# EAGLE design column (EAGLE 6.2)
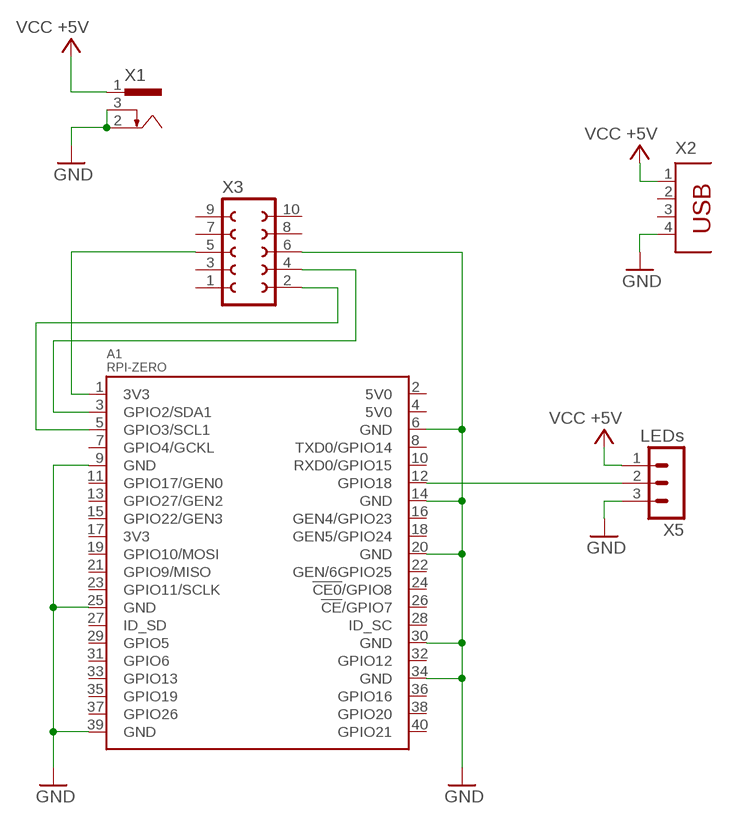
[diagram p0: schematic, sheet 1]

## Parts
A1  RPI-ZERO  [RASP_PI_ZERO_BOARD_FULL]
X1  733980-62  [733980-62]
X2  PN87520  [PN87520]
X3  FE05-2  [FE05-2]
X5  LEDs  MA03-1  [MA03-1]

## Nets
3V3@1: A1.1(3V3) X3.5
GND: A1.6(GND) A1.9(GND) A1.14(GND) A1.20(GND) A1.25(GND) A1.30(GND) A1.34(GND) A1.39(GND) X1.2 X1.3 X2.4 X3.6 X5.3
N$1: A1.5(GPIO3/SCL1) X3.2
N$2: A1.3(GPIO2/SDA1) X3.4
N$3: A1.12(GPIO18) X5.2
VCC: X1.1 X2.1 X5.1 ; supply symbol labelled VCC +5V
Unconnected: A1.2(5V0) A1.4(5V0) A1.7(GPIO4/GCKL) A1.8(TXD0/GPIO14) A1.10(RXD0/GPIO15) A1.11(GPIO17/GEN0) A1.13(GPIO27/GEN2) A1.15(GPIO22/GEN3) A1.16(GEN4/GPIO23) A1.17(3V3) A1.18(GEN5/GPIO24) A1.19(GPIO10/MOSI) A1.21(GPIO9/MISO) A1.22(GEN/6GPIO25) A1.23(GPIO11/SCLK) A1.24(!CE0!/GPIO8) A1.26(!CE!/GPIO7) A1.27(ID_SD) A1.28(ID_SC) A1.29(GPIO5) A1.31(GPIO6) A1.32(GPIO12) A1.33(GPIO13) A1.35(GPIO19) A1.36(GPIO16) A1.37(GPIO26) A1.38(GPIO20) A1.40(GPIO21) X2.2 X2.3 X3.1 X3.3 X3.7 X3.8 X3.9 X3.10

## Library data of the parts
A1 = rpi-zero-without-test-pad:RPI-ZERO
X1 = con-conrad:73398?: FEMALE PRINT CONNECTOR Niedervolt-Steckverbinder Distributor Conrad
X2 = con-berg:PN87520: BERG USB connector; OC_FARNELL: unknown; OC_NEWARK: unknown
X3 = con-lsta:FE05-2: FEMALE HEADER; OC_FARNELL: unknown; OC_NEWARK: unknown
X5 = con-lstb:MA03-1: PIN HEADER; OC_FARNELL: unknown; OC_NEWARK: unknown

## Board
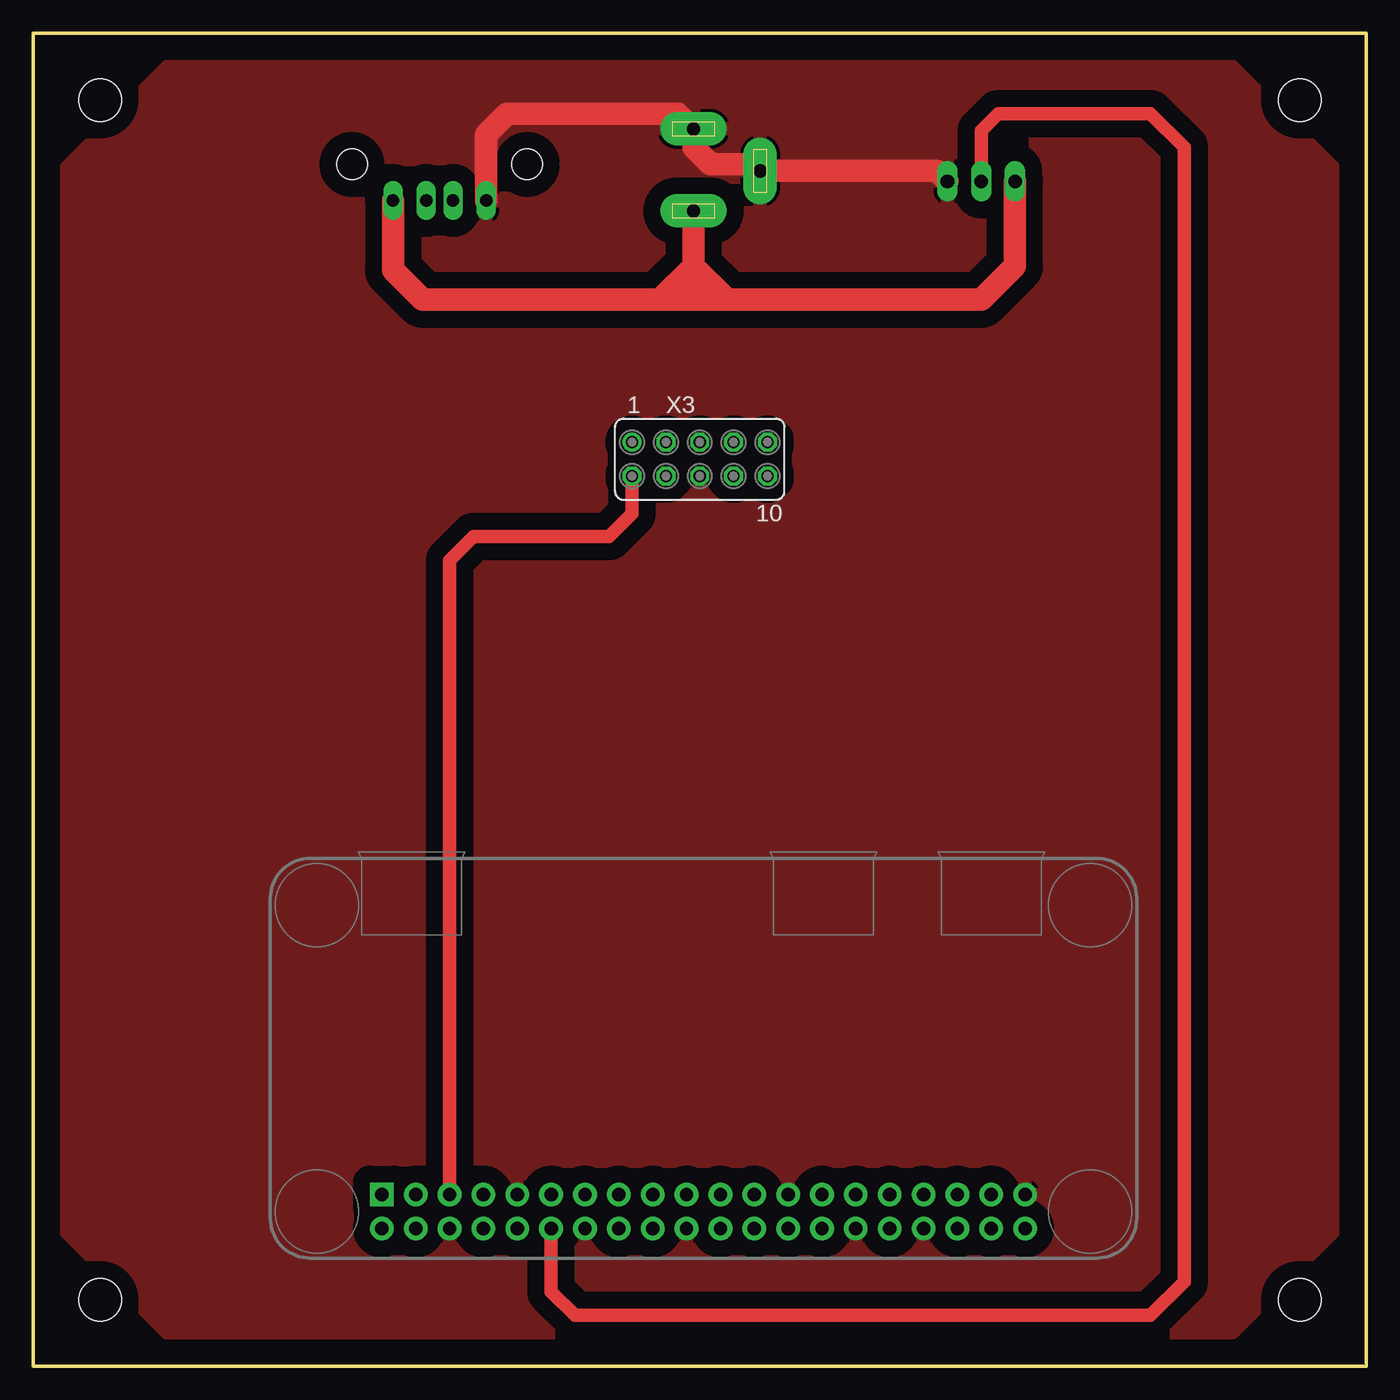
[diagram p1: board, top side]
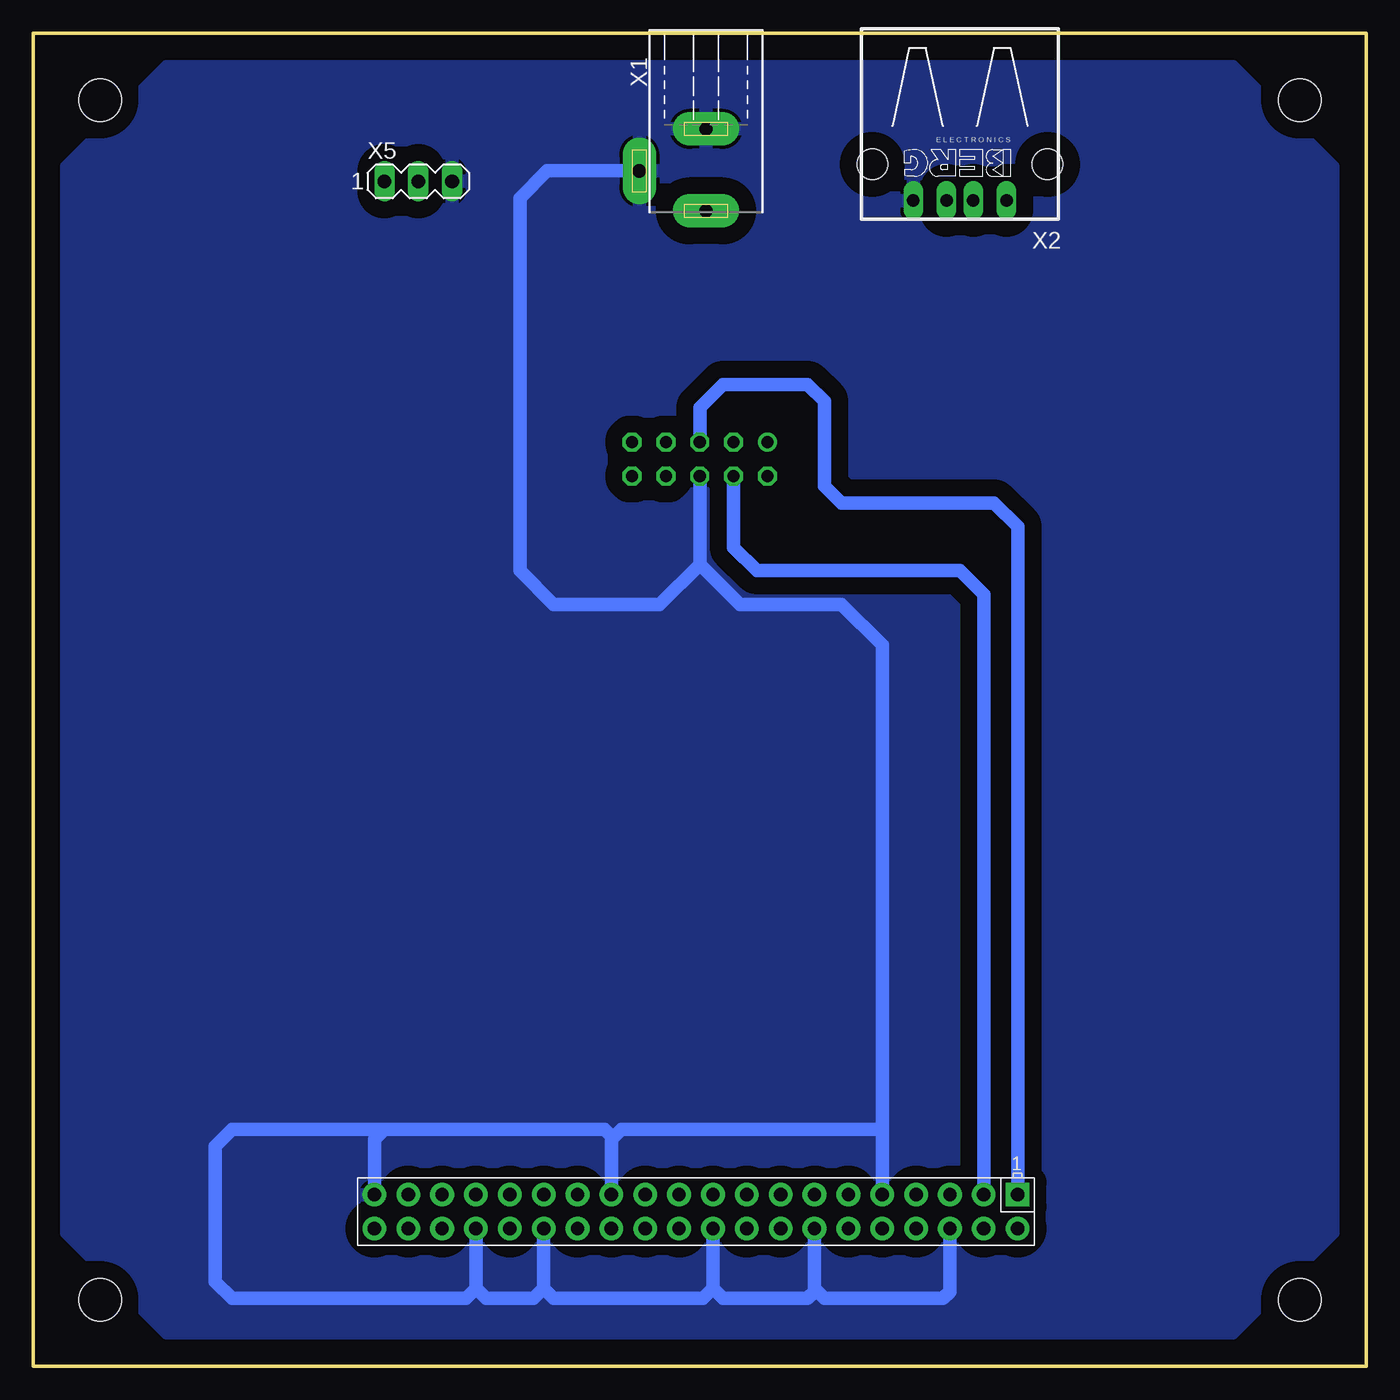
[diagram p2: board, bottom side, seen from below]

Size 100 x 100 mm. Coordinates in mm from the lower left corner, seen from the top.
Outline: 0,0 100,0 100,100 0,100 0,0
Copper layers (1*16): Top 0.035mm / dielectric 1.5mm / Bottom 0.035mm
Design rules: minimum track width 10mil, minimum drill 24mil, track to track 8mil, track to pad 8mil, pad to pad 8mil, via to via 8mil, smd to smd 8mil, copper to edge 40mil, drill to drill 8mil, minimum pad ring 10mil, minimum via ring 8mil, stop-mask expansion 4mil, vias tented up to drill 0mil, thermal gap 10mil
Holes 3.2 mm at 5,95 95,95 95,5 5,5

### Footprints (pad centres in the part's own frame; a part is rotated, then mirrored left to right if it is on the bottom)
RASP_PI_ZERO_BOARD_FULL = drill 1 pad 1.778 square: 1 8.37,25.23 | drill 1 pad 1.778: 2 8.37,27.77; 3 10.91,25.23; 4 10.91,27.77; 5 13.45,25.23; 6 13.45,27.77; 7 15.99,25.23; 8 15.99,27.77; 9 18.53,25.23; 10 18.53,27.77; 11 21.07,25.23; 12 21.07,27.77; 13 23.61,25.23; 14 23.61,27.77; 15 26.15,25.23; 16 26.15,27.77; 17 28.69,25.23; 18 28.69,27.77; 19 31.23,25.23; 20 31.23,27.77; 21 33.77,25.23; 22 33.77,27.77; 23 36.31,25.23; 24 36.31,27.77; 25 38.85,25.23; 26 38.85,27.77; 27 41.39,25.23; 28 41.39,27.77; 29 43.93,25.23; 30 43.93,27.77; 31 46.47,25.23; 32 46.47,27.77; 33 49.01,25.23; 34 49.01,27.77; 35 51.55,25.23; 36 51.55,27.77; 37 54.09,25.23; 38 54.09,27.77; 39 56.63,25.23; 40 56.63,27.77
733980-62 = drill 1 pad 2.5 long: 1 0,8.57; 2 0,2.42; 3 5,5.57
PN87520 = drill 0.95 long: 1 -3.5,2.71; 2 -1,2.71; 3 1,2.71; 4 3.5,2.71 | hole 2.3: -6.57,0; 6.57,0
FE05-2 = drill 0.914: 1 -5.08,1.27 | drill 0.914 octagon: 2 -5.08,-1.27; 3 -2.54,1.27; 4 -2.54,-1.27; 5 0,1.27; 6 0,-1.27; 7 2.54,1.27; 8 2.54,-1.27; 9 5.08,1.27; 10 5.08,-1.27
MA03-1 = drill 1.016 long: 1 -2.54,0; 2 0,0; 3 2.54,0

### Placement (x,y rotation side)
A1  17.78,38.1 180 bottom
X1  49.53,95.25 180 bottom
X2  30.48,90.17 180 bottom
X3  50,68.05 0 top
X5  71.12,88.9 0 bottom

### Tracks (layer width: path | path; a pad name or v marks a point on that pad's centre or on a via)
3V3@1
  Bottom 1.016: X3.5 50,71.92 48.26,73.66 41.91,73.66 40.64,72.39 40.64,66.04 39.37,64.77 27.94,64.77 26.15,62.98 A1.1
GND
  Top 1.676: X2.4 33.98,92.4 35.56,93.98 48.38,93.98 X1.2 49.53,91.44 50.8,90.17 54.04,90.17 X1.3 67.8,89.68 X5.3
  Bottom 1.016: X3.6 50,60.16 | 50,60.16 46.99,57.15 39.37,57.15 36.31,54.09 36.31,17.78 | A1.9 36.31,17.78 | 36.31,17.78 55.88,17.78 56.63,17.03 A1.25 56.63,17.26 57.15,17.78 73.66,17.78 | A1.39 74.41,17.03 73.66,17.78 | A1.6 31.23,5.6 31.75,5.08 40.64,5.08 41.39,5.83 | A1.14 41.39,5.83 | A1.20 49.01,5.83 | 49.01,5.83 48.26,5.08 41.91,5.08 41.39,5.6 41.39,5.83 | A1.30 61.71,5.83 | 61.71,5.83 60.96,5.08 49.76,5.08 49.01,5.83 | A1.34 66.79,5.83 | 66.79,5.83 66.04,5.08 62.46,5.08 61.71,5.83 | 73.66,17.78 85.09,17.78 86.36,16.51 86.36,6.35 85.09,5.08 67.54,5.08 66.79,5.83 | X1.3 61.45,89.68 63.5,87.63 63.5,59.69 60.96,57.15 53.01,57.15 50,60.16
  pour Bottom (isolate 1.27): 10,2.5 90,2.5 97.5,10 97.5,90 90,97.5 10,97.5 2.5,90 2.5,10
  pour Top (isolate 1.27): 10,2.5 90,2.5 97.5,10 97.5,90 90,97.5 10,97.5 2.5,90 2.5,10
N$1
  Top 1.016: X3.2 44.92,63.97 43.18,62.23 33.02,62.23 31.23,60.44 A1.5
N$2
  Bottom 1.016: X3.4 47.46,61.43 45.72,59.69 30.48,59.69 28.69,57.9 A1.3
N$3
  Top 1.016: X5.2 71.12,92.71 72.39,93.98 83.82,93.98 86.36,91.44 86.36,6.35 83.82,3.81 40.64,3.81 38.85,5.6 A1.12
VCC
  Top 1.676: X2.1 26.98,82.24 29.21,80.01 46.99,80.01 | 46.99,80.01 50.8,80.01 | 52.07,80.01 71.12,80.01 73.66,82.55 X5.1 | X1.1 49.53,82.55 | 49.53,82.55 46.99,80.01 | 49.53,82.55 52.07,80.01 | 52.07,80.01 50.8,80.01 | 50.8,80.01 49.53,81.28